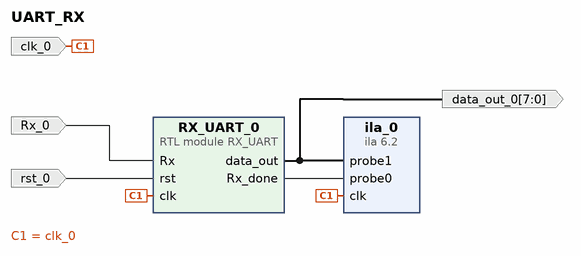
[diagram p0: block diagram of the top level]
# Vivado block design UART_RX, xc7a35ticsg324-1L, Vivado 2020.2.2
create_bd_design UART_RX

create_bd_port -dir I Rx_0
create_bd_port -dir O -from 7 -to 0 data_out_0
create_bd_port -dir I -type clk clk_0
create_bd_port -dir I -type rst rst_0

create_bd_cell -type ip -vlnv xilinx.com:ip:ila:6.2 ila_0
set_property -dict [list \
  CONFIG.C_ENABLE_ILA_AXI_MON false \
  CONFIG.C_MONITOR_TYPE Native \
  CONFIG.C_NUM_OF_PROBES 2 \
  CONFIG.C_PROBE1_WIDTH 8 \
] [get_bd_cells ila_0]
create_bd_cell -type module -reference RX_UART RX_UART_0

# ---- connections ----

connect_bd_net -net FSM_RX_0_data_out [get_bd_pins RX_UART_0/data_out] [get_bd_ports data_out_0] [get_bd_pins ila_0/probe1]
connect_bd_net -net Rx_0_1 [get_bd_ports Rx_0] [get_bd_pins RX_UART_0/Rx]
connect_bd_net [get_bd_pins RX_UART_0/Rx_done] [get_bd_pins ila_0/probe0]
connect_bd_net -net clk_0_1 [get_bd_ports clk_0] [get_bd_pins ila_0/clk] [get_bd_pins RX_UART_0/clk]
connect_bd_net -net rst_0_1 [get_bd_ports rst_0] [get_bd_pins RX_UART_0/rst]

validate_bd_design
save_bd_design
